# EAGLE design Non rechargeable (EAGLE 7.3.0)
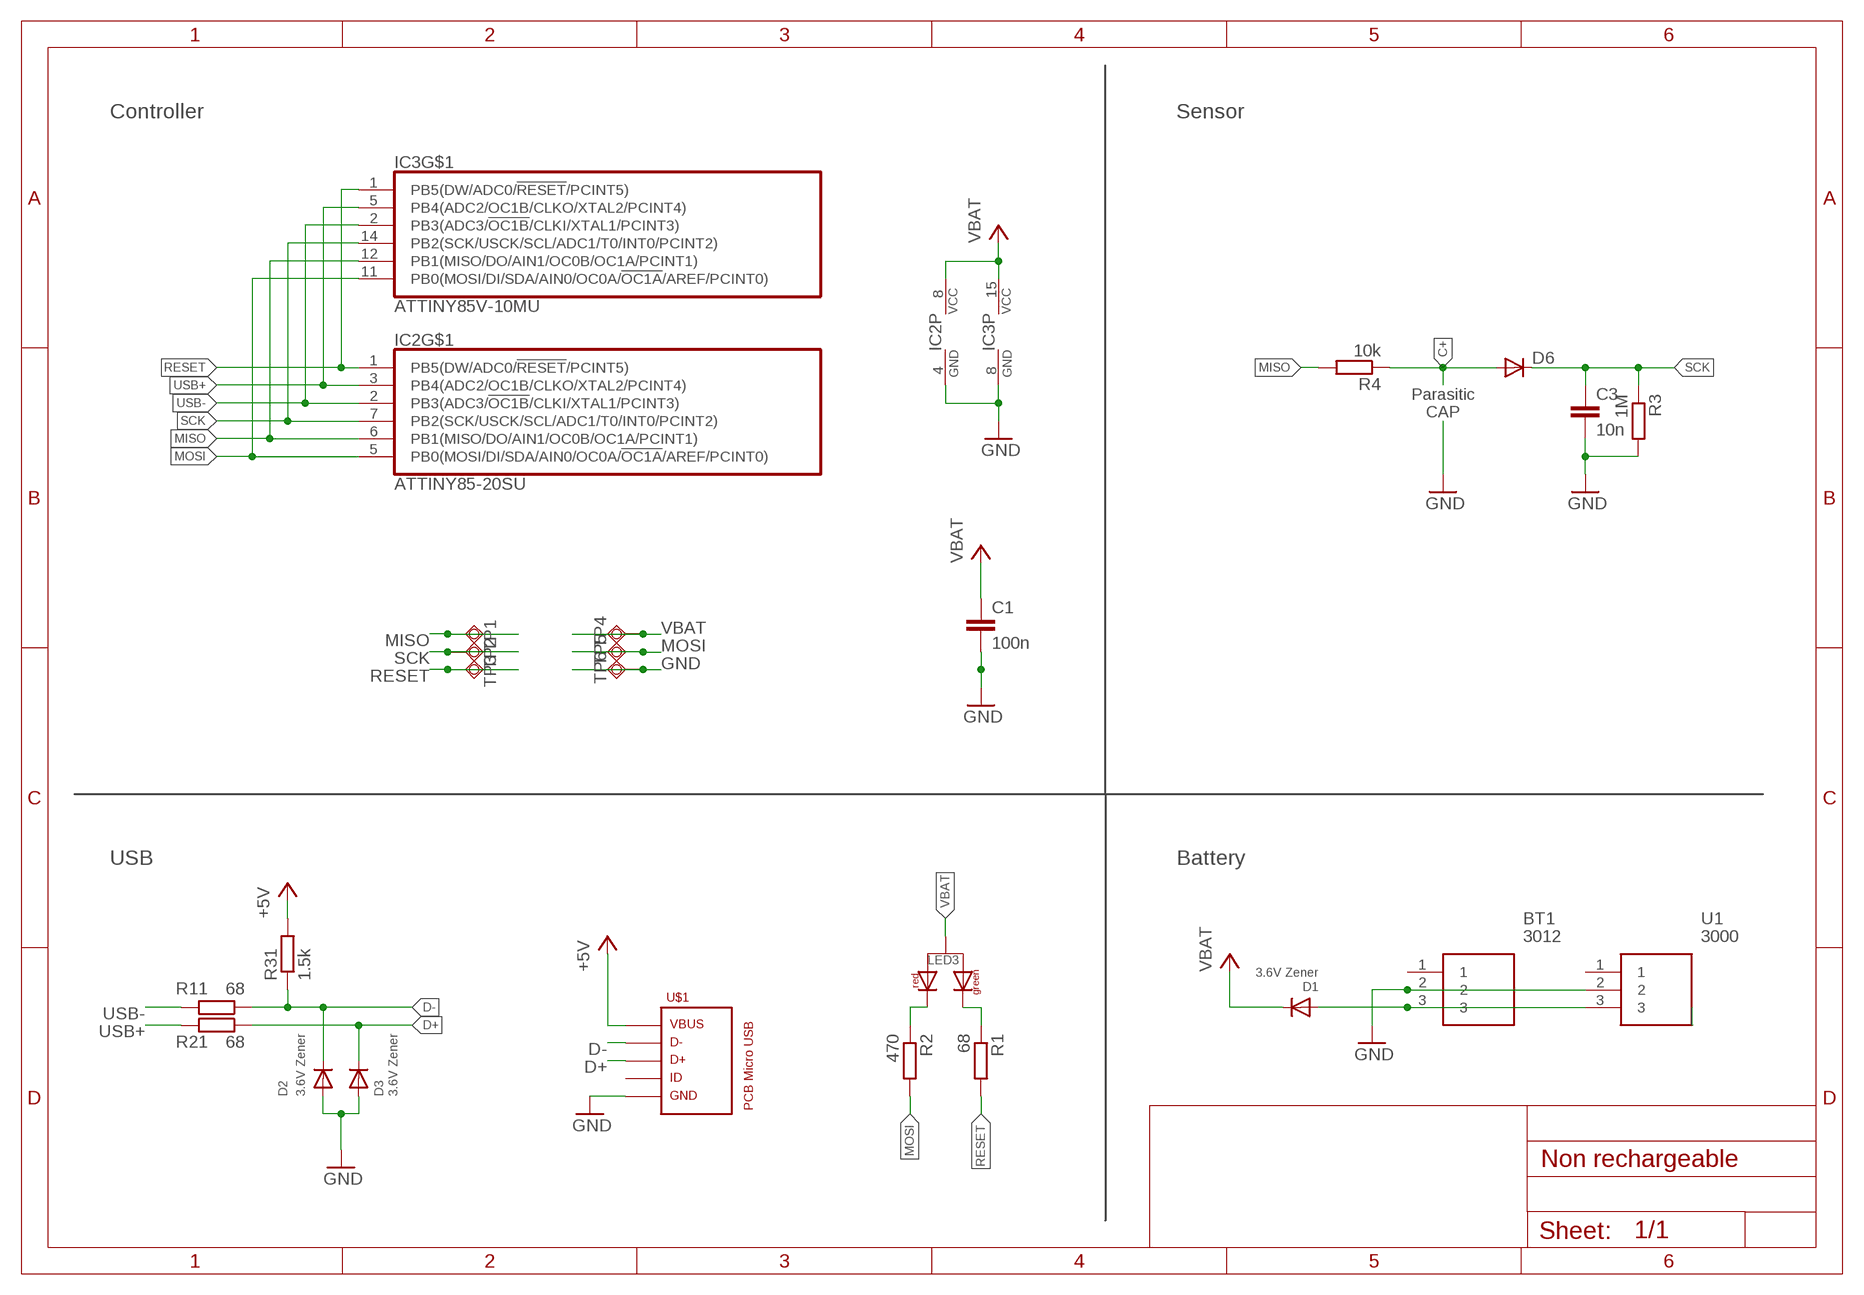
[diagram p0: schematic, sheet 1]

## Parts
BT1  3012  [3012]
C1  100n  C-EUC0603  [C0603]
C3  10n  C-EU025-024X044  [C025-024X044]
D1  3.6V Zener  DIODESOD-323F  [SOD-323F]
D2  3.6V Zener  DIODESOD-323F  [SOD-323F]
D3  3.6V Zener  DIODESOD-323F  [SOD-323F]
D6  DIODE-D-5  [D-5]
IC2  ATTINY85-20SU  [8S2]
IC3  ATTINY85V-10MU  [QFN20_4X4_0.50]
LED3  KPBA-3010SURKCGKC3MM  [3MMLED]
R1  68  R-EU_0204/7  [0204/7]
R2  470  R-EU_0204/7  [0204/7]
R3  1M  R-EU_0204/7  [0204/7]
R4  10k  R-EU_0204/7  [0204/7]
R11  68  R-EU_R0603  [R0603]
R21  68  R-EU_R0603  [R0603]
R31  1.5k  R-EU_R0603  [R0603]
TP1  TPSQTP15R  [TP15R]
TP2  TPSQTP15R  [TP15R]
TP3  TPSQTP15R  [TP15R]
TP4  TPSQTP15R  [TP15R]
TP5  TPSQTP15R  [TP15R]
TP6  TPSQTP15SQ  [TP15SQ]
U1  3000  [3000]
U$1  PCB_MICRO_USB_BSS_3  [USB_TYPE_B_SS_3]

## Nets
C+: D6.A R4.1
D+: D3.C R21.1 U$1.3
D-: D2.C R11.1 R31.1 U$1.2
GND: BT1.2 C1.2 C3.2 D2.A D3.A IC2.4(P:GND) IC3.8(P:GND) R3.2 TP6.TP U1.2 U$1.5
MISO: IC2.6(PB1(MISO/DO/AIN1/OC0B/OC1A/PCINT1)) IC3.12(PB1(MISO/DO/AIN1/OC0B/OC1A/PCINT1)) R4.2 TP1.TP
MOSI: IC2.5(PB0(MOSI/DI/SDA/AIN0/OC0A/!OC1A!/AREF/PCINT0)) IC3.11(PB0(MOSI/DI/SDA/AIN0/OC0A/!OC1A!/AREF/PCINT0)) R2.2 TP5.TP
N$1: LED3.-2 R1.1
N$3: LED3.-1 R2.1
RESET: IC2.1(PB5(DW/ADC0/!RESET!/PCINT5)) IC3.1(PB5(DW/ADC0/!RESET!/PCINT5)) R1.2 TP3.TP
SCK: C3.1 D6.C IC2.7(PB2(SCK/USCK/SCL/ADC1/T0/INT0/PCINT2)) IC3.14(PB2(SCK/USCK/SCL/ADC1/T0/INT0/PCINT2)) R3.1 TP2.TP
USB+: IC2.3(PB4(ADC2/OC1B/CLKO/XTAL2/PCINT4)) IC3.5(PB4(ADC2/OC1B/CLKO/XTAL2/PCINT4)) R21.2
USB-: IC2.2(PB3(ADC3/!OC1B!/CLKI/XTAL1/PCINT3)) IC3.2(PB3(ADC3/!OC1B!/CLKI/XTAL1/PCINT3)) R11.2
VB: BT1.3 D1.A U1.3
VBAT: C1.1 D1.C IC2.8(P:VCC) IC3.15(P:VCC) LED3.+ R31.2 TP4.TP U$1.1 ; supply symbol labelled +5V
Unconnected: BT1.1 U1.1 U$1.4

## Notes on the sheet
- Controller | Sensor
- Parasitic
  CAP
- USB | Battery

## Library data of the parts
BT1 = SamacSys_Parts:3012: BATTERY SOCKET Keystone PCB Mount Battery Contact for 1 (Coin Cell), Top Spring Arm Contact, 16mm Cell Diameter Source: Datasheet; DESCRIPTION: BATTERY SOCKET Keystone PCB Mount Battery Contact for 1 (Coin Cell), Top Spring Arm Contact, 16mm Cell Diameter; HEIGHT: mm; MANUFACTURER_NAME: Keystone Electronics; MANUFACTURER_PART_NUMBER: 3012; MOUSER_PART_NUMBER: 534-3012; MOUSER_PRICE-STOCK: https://www.mouser.co.uk/ProductDetail/Keystone-Electronics/3012?qs=xHlTOBifBJMOp38NsFwOBg%3D%3D
C1 = rcl:C-EU: CAPACITOR, European symbol
C3 = resistor:C-EU: CAPACITOR, European symbol
D1-D3 = adafruit:DIODE: Diode SMADIODE - SMA Surface Mount Package 20V 1A Schottky Diode Digikey: 641-1014-6-ND DO-1N4148 - Through Hole Small Current Diode SOD-123 20V 1 A (.5mV Vf) Schottky Diode - Digikey: MBRX120TPMSCT-ND SOD-323 10V 570mA (.38mV Vf, 3ns) Schottky Diode - Digikey: ZLLS410CT-ND SOD-523 30V 30mA Schottky Diode (RB751S-40TE61) - Digikey: RB751S-40TE61CT-ND SOT23-R/W - SOT23 Package (R = Solder Paste/Reflow Ovens, W = Hand-Soldering) BAT54Film 40V 300mA - Digikey: 497-7162-1-ND
D6 = diode:DIODE-: DIODE
IC2 IC3 = atmel:ATTINY*5: 8-bit AVR tiny Microcontroller Status aktiv aktiv aktiv ATtiny25(V) ATtiny45(V) ATtiny85(V) General purpose working registers 32 SRAM 128 B 256 B 512 B Program flash memory 2 kB 4 kB 8 kB EEPROM 128 B 256 B 512 B 8-bit Timer/Counter 1 8-bit Timer/Counter (high speed) 1 USI 1 ADC channels 4 ADC resolution 10 bit AC 1 Watchdog 1 General purpose I/O 6 External interrupts 6 Operating voltage 1.8 ... 5.5 V for ATtiny#5V 2.7 ... 5.5 V for ATtiny#5 Speed grade 0 ... 4 MHz @ 1.8 ... 5.5 V for ATtiny#5V 0 ... 10 MHz @ 2.7 ... 5.5 V for ATtiny#5V 0 ... 10 MHz @ 2.7 ... 5.5 V for ATtiny#5 0 ... 20 MHz @ 4.5 ... 5.5V for ATtiny#5 Clock options calibrated internal 8/6.4 MHz oscillator external crystal oscillator / ceramic resonator external 32.768 kHz low-frequency crystal oscillator internal 128 kHz oscillator high frequency PLL clock external clock input
LED3 = pcb_xmas_custom_components:KPBA-3010SURKCGKC
R1-R4 = resistor:R-EU_: RESISTOR, European symbol
R11 R21 R31 = rcl:R-EU_: RESISTOR, European symbol
TP1-TP6 = testpad:TPSQ: Test pad
U1 = SamacSys_Parts:3000: KEYSTONE - 3000 - Battery Contact, Coin Cell - 12mm, SMD, Phosphor Bronze Source: Datasheet <https://componentsearchengine.com/Datasheets/2/3000.pdf>; DESCRIPTION: KEYSTONE - 3000 - Battery Contact, Coin Cell - 12mm, SMD, Phosphor Bronze; HEIGHT: 3.2mm; MANUFACTURER_NAME: Keystone Electronics; MANUFACTURER_PART_NUMBER: 3000; MOUSER_PART_NUMBER: 534-3000; MOUSER_PRICE-STOCK: https://www.mouser.co.uk/ProductDetail/Keystone-Electronics/3000?qs=Mn60vILZNNbcLh3ZnzbtUw%3D%3D
U$1 = USB_pcb_connectors:PCB_MICRO_USB_B

## Net classes
0 default: clearance 0.205 mm

## Board
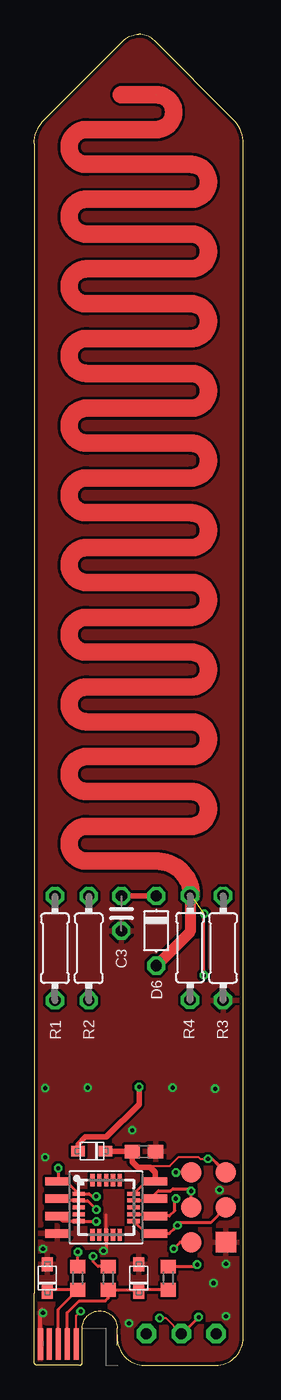
[diagram p1: board, top side]
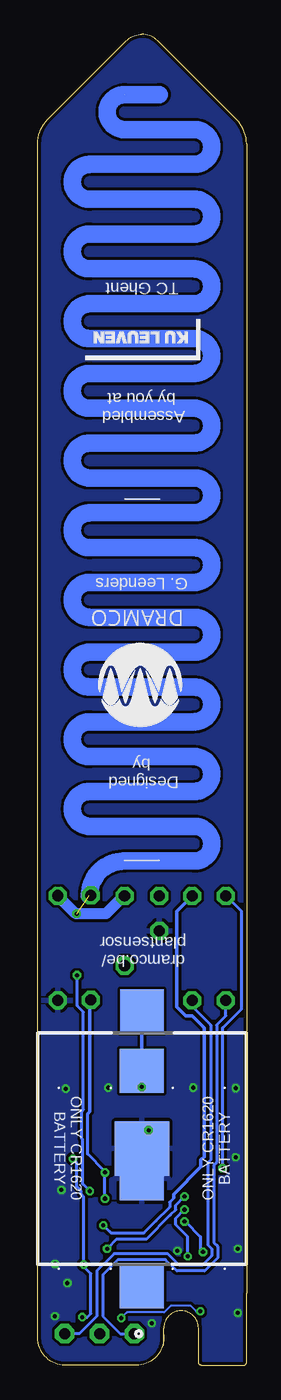
[diagram p2: board, bottom side, seen from below]

Size 15.22 x 97.04 mm. Coordinates in mm from the lower left corner, seen from the top.
Outline: 0,5.24 0,89.06 arc-45 0.73,90.82 6.47,96.56 arc-45 7.62,97.04 arc-45 8.77,96.56 14.51,90.82 arc-45 15.22,89.06 15.22,2 arc-90 13.24,0 8.03,0 arc-90 6.04,2 6.04,2.22
Copper layers (1*16): Top 0.035mm / dielectric 1.5mm / Bottom 0.035mm
Design rules "SeeedStudio_2layer_DRU_no_angle_20140221": minimum track width 6mil, minimum drill 12mil, track to track 6mil, track to pad 6mil, pad to pad 6mil, via to via 6mil, smd to smd 0mil, copper to edge 10mil, drill to drill 10mil, minimum pad ring 10mil, minimum via ring 6mil, stop-mask expansion 2mil, vias tented up to drill 100mil, thermal gap 10mil

### Footprints (pad centres in the part's own frame; a part is rotated, then mirrored left to right if it is on the bottom)
3012 = smd 3.18 x 3.18: 1 -10.02,0; 3 10.02,0 | smd 3.96 x 3.96: 2 0,0
C0603 = smd 1.1 x 1: 1 -0.85,0; 2 0.85,0
C025-024X044 = drill 0.813 octagon: 1 -1.27,0; 2 1.27,0
SOD-323F = smd 1 x 0.8: A -1,0; C 1,0
D-5 = drill 0.813 octagon: A 2.54,0; C -2.54,0
8S2 = smd 0.6 x 1.8: 1 -1.905,-3.55; 2 -0.635,-3.55; 3 0.635,-3.55; 4 1.905,-3.55; 5 1.905,3.55; 6 0.635,3.55; 7 -0.635,3.55; 8 -1.905,3.55
QFN20_4X4_0.50 = smd 0.9 x 0.3: 1 -2,1; 2 -2,0.5; 3 -2,0; 4 -2,-0.5; 5 -2,-1; 11 2,-1; 12 2,-0.5; 13 2,0; 14 2,0.5; 15 2,1 | smd 0.3 x 0.9: 6 -1,-2; 7 -0.5,-2; 8 0,-2; 9 0.5,-2; 10 1,-2; 16 1,2; 17 0.5,2; 18 0,2; 19 -0.5,2; 20 -1,2
3MMLED = drill 0.8 pad 1.422 octagon: + 0,0; -1 -2.54,0; -2 2.54,0
0204/7 = drill 0.813 octagon: 1 -3.81,0; 2 3.81,0
R0603 = smd 1 x 1.1: 1 -0.85,0; 2 0.85,0
TP15R = smd 1.5 x 1.5: TP 0,0
TP15SQ = smd 1.5 x 1.5: TP 0,0
3000 = smd 3.2 x 3.2: 1 -7.85,0; 2 0,0; 3 7.85,0
USB_TYPE_B_SS_3 = smd 0.37 x 2.3: 1 -1.3,-1.55; 2 -0.65,-1.55; 3 0,-1.55; 4 0.65,-1.55; 5 1.3,-1.55

### Placement (x,y rotation side)
BT1  7.62,15.8 90 bottom
C1  7.99,15.58 0 top
C3  6.35,32.94 270 top
D1  4.19,15.61 0 top
D2  7.62,6.35 270 top
D3  0.95,6.35 270 top
D6  8.89,31.67 270 top
IC2  5.24,11.51 270 top
IC3  5.24,11.51 0 top
LED3  10.72,2.3 180 top
R1  1.51,30.4 90 top
R2  3.97,30.4 90 top
R3  13.75,30.42 270 top
R4  11.35,30.44 270 top
R11  5.4,6.35 90 top
R21  3.17,6.35 90 top
R31  9.76,6.35 90 top
TP1  11.43,14.05 180 top
TP2  11.43,11.51 180 top
TP3  11.43,8.97 180 top
TP4  13.97,14.05 180 top
TP5  13.97,11.51 180 top
TP6  13.97,8.97 180 top
U1  7.65,13.61 90 bottom
U$1  1.75,0 180 top

### Tracks (layer width: path | path; a pad name or v marks a point on that pad's centre or on a via)
C+
  Top 0.813: R4.1 11.35,31.59 D6.A
D+
  Top 0.203: 1.1,5.5 D3.C 1.02,5.5 R21.1 1.75,4.07 U$1.3
D-
  Top 0.203: R31.1 7.77,5.5 D2.C 7.47,5.5 R11.1 5.39,4.9 5.18,4.69 3.26,4.69 3.18,4.6 | U$1.2 2.4,3.83 3.18,4.6 | 3.18,4.6
GND  (via drill 0.3)
  Top 0.203: 5.24,10.93 IC3.8 5.24,8.53 v5.04,8.33
  Top 0.305: U$1.5 0.45,3.94 0.56,4.05
  other vias: 0.64,8.49 13.97,7.38 13.49,12.78 13.97,3.57 0.64,3.81 13.06,5.99 3.89,20.24 0.79,15.16 13.18,20.16 10.08,20.24 0.79,20.2 7.14,17.13 6.91,3.06
  pour Bottom: 43.18,-6.43 -13.97,-6.43 -13.97,100.25 43.18,100.25
  pour Top: -13.97,-6.43 43.18,-6.43 43.18,100.25 -13.97,100.25
MISO  (via drill 0.3)
  Top 0.203: IC3.12 8.65,11.01 IC2.6 9.84,10.87 10.24,11.27 10.24,12.07 v10.32,12.15 | 11.27,14.05 TP1.TP v10.32,14.05
  Bottom 0.203: 11.43,18.49 11.59,18.34 11.59,15.4 10.32,14.13 v10.32,14.05 v10.32,12.15
  Bottom 0.254: 11.43,18.49 11.43,26.55 R4.2
MOSI  (via drill 0.3)
  Top 0.203: IC3.11 8.14,9.6 IC2.5 9.84,9.6 10.2,9.96 | TP5.TP 12.86,10.4 10.64,10.4 v10.44,10.2
  Top 0.254: v10.44,10.2 10.2,9.96
  Bottom 0.203: 5.32,12.22 5.32,12.18 5.6,11.89 5.6,11.52 6.61,10.52 | 6.61,10.52 | 6.61,10.52 7.48,9.65 9.88,9.65 9.96,9.73 v10.43,10.2 v10.44,10.2
  Bottom 0.254: R2.2 5.08,33.1 5.08,26.13 4.43,25.48 3.96,25.48 3.09,24.61 3.09,15.19 3.25,15.04 | 5.32,12.22 5.32,12.46 3.33,14.45 3.33,14.96 3.25,15.04 | 3.25,15.04
N$1
  Bottom 0.203: LED3.-2 9.21,2.3 10.48,3.57 10.48,6.61 9.39,7.7 5.91,7.7 5.08,6.87 3.06,6.87 2.1,7.82 2.1,8.65 2.38,8.93 2.38,14.61 2.18,14.8 2.18,24.8 1.51,25.48 R1.1
N$3
  Bottom 0.203: LED3.-1 12.18,2.3 10.91,3.57 10.91,6.87 9.65,8.14 5.75,8.14 4.92,7.3 3.21,7.3 2.54,7.98 2.54,8.49 2.82,8.77 2.82,14.76 2.62,14.96 2.62,24.8 3.97,26.15 R2.1
RESET  (via drill 0.3)
  Top 0.203: IC3.1 2.33,13.41 IC2.1 1.75,13.47 v1.75,14.37 | TP3.TP 10.64,8.97 v10.16,8.49 | 3.27,12.54 IC3.1 | v4.52,12.3 4.21,12.3 4,12.51 IC3.1
  Bottom 0.203: v4.52,12.3 5.16,11.67 5.16,11.34 5.55,10.95 7.29,9.21 9.44,9.21 v10.16,8.49 | v1.75,14.37 1.75,24.61 0.4,25.96 0.4,33.14 1.47,34.21 R1.2
SCK  (via drill 0.3)  (2 unrouted)
  Top 0.203: TP2.TP v11.43,12.7 | 7.22,11.99 IC3.14 8.65,12.01 IC2.7 8.79,12.46 9.04,12.72 9.93,12.72 10.09,12.88 11.25,12.88 v11.43,12.7 | v12.36,28.43 12.36,32.89 v12.38,32.91 | v11.43,12.7
  Top 0.406: D6.C C3.1
  Top 1.27: 6.35,92.63 8.89,92.63 arc-90 10.16,91.36 arc-90 8.89,90.09 3.81,90.09 arc90 2.54,88.82 arc90 3.81,87.55 11.43,87.55 arc-90 12.7,86.28 arc-90 11.43,85.01 3.81,85.01 arc90 2.54,83.74 arc90 3.81,82.47 11.43,82.47 arc-90 12.7,81.2 arc-90 11.43,79.93 3.81,79.93 arc90 2.54,78.66 arc90 3.81,77.39 11.43,77.39 arc-90 12.7,76.12 arc-90 11.43,74.85 3.81,74.85 arc90 2.54,73.58 arc90 3.81,72.31 11.43,72.31 arc-90 12.7,71.04 arc-90 11.43,69.77 3.81,69.77 arc90 2.54,68.5 arc90 3.81,67.23 11.43,67.23 arc-90 12.7,65.96 arc-90 11.43,64.69 3.81,64.69 arc90 2.54,63.42 arc90 3.81,62.15 11.43,62.15 arc-90 12.7,60.88 arc-90 11.43,59.61 3.81,59.61 arc90 2.54,58.34 arc90 3.81,57.07 11.43,57.07 arc-90 12.7,55.8 arc-90 11.43,54.53 3.81,54.53 arc90 2.54,53.26 arc90 3.81,51.99 11.43,51.99 arc-90 12.7,50.72 arc-90 11.43,49.45 3.81,49.45 arc90 2.54,48.18 arc90 3.81,46.91 11.43,46.91 arc-90 12.7,45.64 arc-90 11.43,44.37 3.81,44.37 arc90 2.54,43.1 arc90 3.81,41.83 11.43,41.83 arc-90 12.7,40.56 arc-90 11.43,39.29 3.81,39.29 arc90 2.54,38.02 arc90 3.81,36.75 8.95,36.75 arc-90 11.45,34.25
  Bottom 0.203: v11.43,12.7 v11.44,12.7 11.95,13.21 11.95,16.47 12.02,16.53 12.02,18.52 11.89,18.65 11.89,25.75 12.34,26.2 12.34,28.41 v12.36,28.43
  Bottom 0.813: D6.C 8.95,34.21 10.18,32.98 10.24,32.91 v12.38,32.91 12.44,32.91 R3.1
  Bottom 1.27: 6.35,92.63 8.89,92.63 arc-90 10.16,91.36 arc-90 8.89,90.09 3.81,90.09 arc90 2.54,88.82 arc90 3.81,87.55 11.43,87.55 arc-90 12.7,86.28 arc-90 11.43,85.01 3.81,85.01 arc90 2.54,83.74 arc90 3.81,82.47 11.43,82.47 arc-90 12.7,81.2 arc-90 11.43,79.93 3.81,79.93 arc90 2.54,78.66 arc90 3.81,77.39 11.43,77.39 arc-90 12.7,76.12 arc-90 11.43,74.85 3.81,74.85 arc90 2.54,73.58 arc90 3.81,72.31 11.43,72.31 arc-90 12.7,71.04 arc-90 11.43,69.77 3.81,69.77 arc90 2.54,68.5 arc90 3.81,67.23 11.43,67.23 arc-90 12.7,65.96 arc-90 11.43,64.69 3.81,64.69 arc90 2.54,63.42 arc90 3.81,62.15 11.43,62.15 arc-90 12.7,60.88 arc-90 11.43,59.61 3.81,59.61 arc90 2.54,58.34 arc90 3.81,57.07 11.43,57.07 arc-90 12.7,55.8 arc-90 11.43,54.53 3.81,54.53 arc90 2.54,53.26 arc90 3.81,51.99 11.43,51.99 arc-90 12.7,50.72 arc-90 11.43,49.45 3.81,49.45 arc90 2.54,48.18 arc90 3.81,46.91 11.43,46.91 arc-90 12.7,45.64 arc-90 11.43,44.37 3.81,44.37 arc90 2.54,43.1 arc90 3.81,41.83 11.43,41.83 arc-90 12.7,40.56 arc-90 11.43,39.29 3.81,39.29 arc90 2.54,38.02 arc90 3.81,36.75 8.95,36.75 arc-90 11.45,34.25
USB+  (via drill 0.3)
  Top 0.203: IC2.3 2.05,10.51 IC3.5 4.49,10.51 v4.52,10.48 | R21.2 v3.18,8.26
  Bottom 0.203: v4.52,10.48 4.48,10.48 3.37,9.37 3.37,8.45 v3.18,8.26
USB-  (via drill 0.3)
  Top 0.203: IC2.2 1.82,12.01 IC3.2 3.26,11.99 3.89,11.99 v4.52,11.35 | R11.2 4.63,7.2 4.29,7.54 v4.29,7.94
  Bottom 0.203: v4.29,7.94 4.29,9.37 5.16,10.24 5.16,10.72 v4.52,11.35
VB  (via drill 0.3)
  Top 0.406: D1.A 3.19,16.1 3.73,16.64 5.26,16.64 7.64,19.01 v7.64,20.28
  Bottom 0.254: BT1.3 7.62,20.3 v7.64,20.28
  Bottom 0.406: v7.64,20.28 U1.3
VBAT  (via drill 0.3)
  Top 0.152: U$1.1 3.05,3.61 v3.37,3.93 | v9.13,3.44 9.58,3.44 LED3.+ | 8.81,13.44 8.81,14.16 8.45,14.51 8.45,14.52 8.47,14.53 9.89,14.53 10.54,15.18 11.96,15.18 12.09,15.05 v12.65,15.05 v12.66,15.05
  Top 0.203: IC2.8 8.14,13.41 IC3.15 | LED3.+ 10.77,2.3 v11.97,3.51 | v12.66,15.05 12.97,15.05 13.26,14.76 | R31.2 11.72,7.2 v11.87,7.34
  Top 0.254: TP4.TP 13.26,14.76
  Top 0.305: LED3.+
  Top 0.406: D1.C 7.1,15.61 C1.1 7.14,14.81 7.53,14.42 8.46,14.42 8.81,14.07 8.81,13.44 IC2.8
  Bottom 0.152: v3.37,3.93 3.68,3.93 4.12,4.37 5.49,4.37 5.58,4.28 6,3.86 8.72,3.86 v9.13,3.44
  Bottom 0.203: v11.97,3.51 11.6,3.51 11.35,3.76 11.35,6.67 11.87,7.19 v11.87,7.34 11.87,12.25 12.06,12.44 12.06,12.71 12.39,13.04 12.39,14.78 v12.66,15.05

### Text on the board
bPlace: TC Ghent | Assembled / by you at | G. Leenders | Designed / by | dramco.be/ / plantsensor
bNames: ONLY CR1620 / BATTERY | ONLY CR1620 / BATTERY